# EAGLE design NightOwl_v5 (EAGLE 7.1.0)
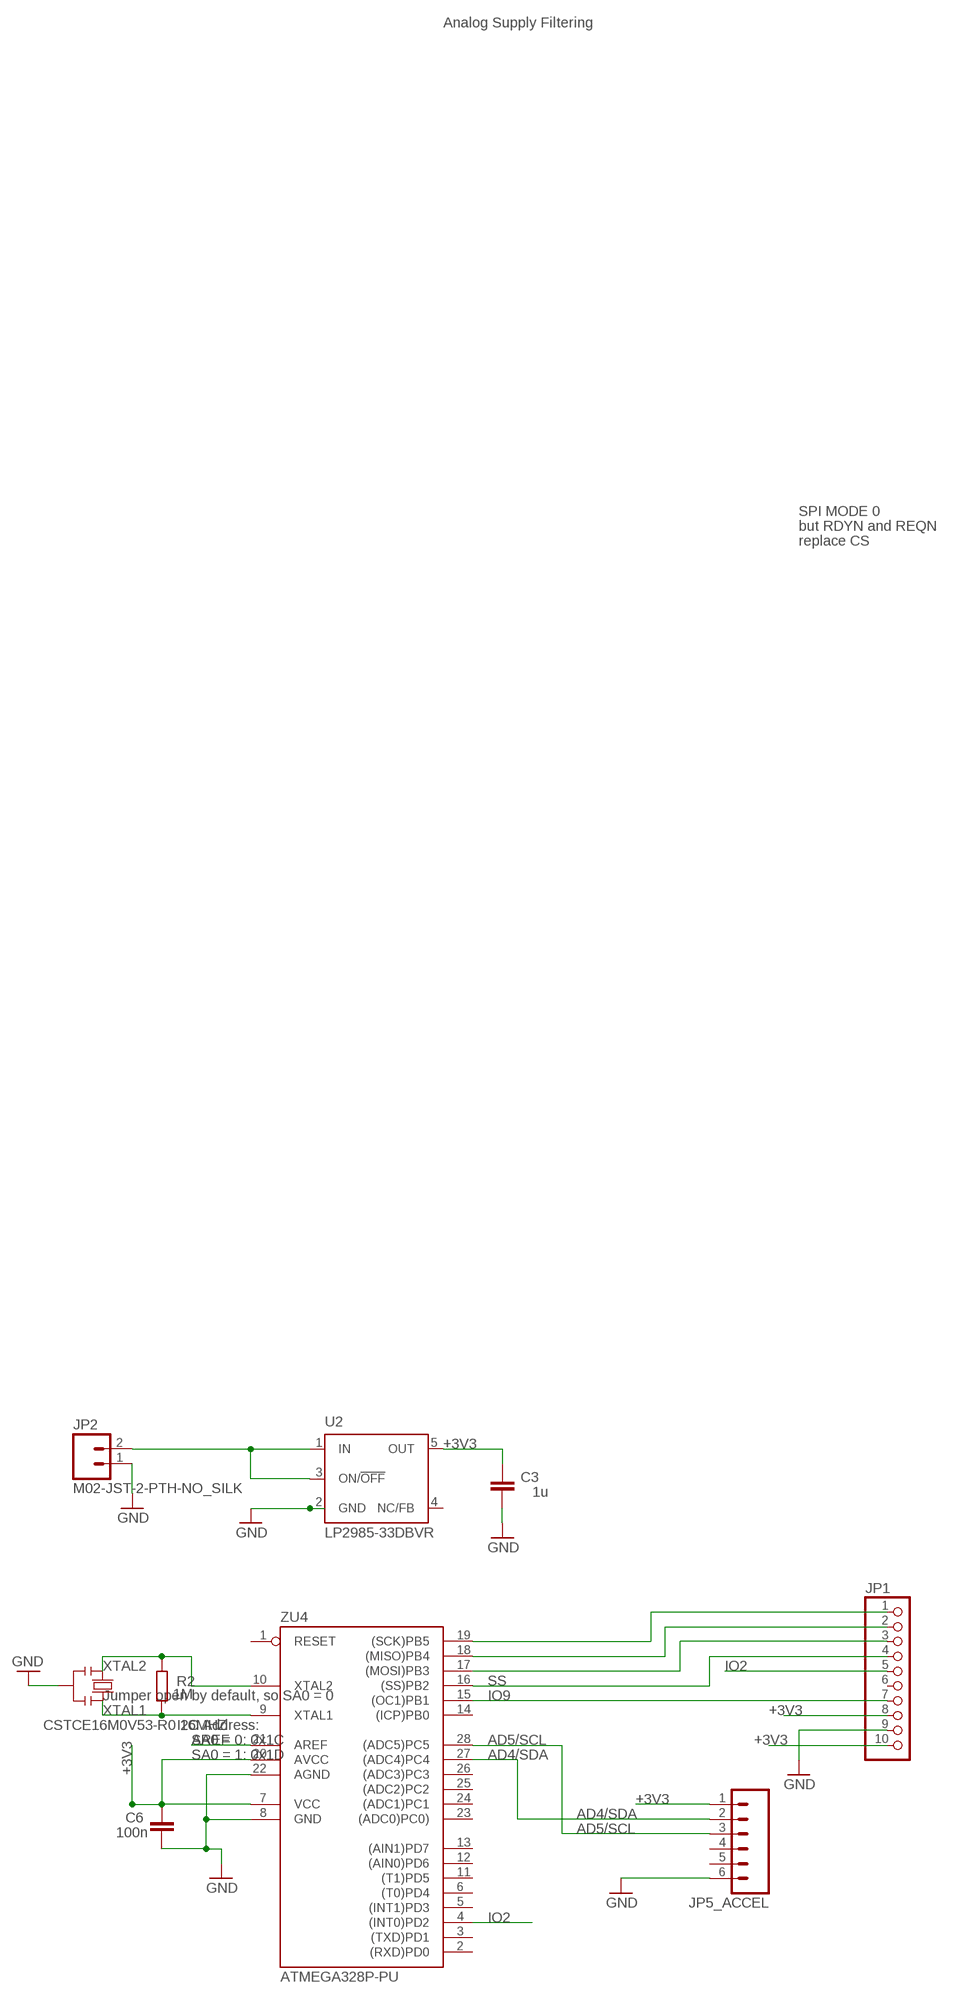
[diagram p0: schematic, sheet 1]

## Parts
C3  1u  C-EU0603-RND  [C0603-ROUND]
C6  100n  C-EU0603-RND  [C0603-ROUND]
JP1  HEADER-1X1070MIL  [1X10_ROUND70]
JP2  M02-JST-2-PTH-NO_SILK  [JST-2-PTH-NS]
JP5_ACCEL  M06SIP  [1X06]
R2  1M  R-EU_R0603  [R0603-ROUND]
U2  LP2985-33DBVR  LP2985-XXDBVR33  [SOT23-DBV]
Y2  CSTCE16M0V53-R0 16MHZ  RESONATORMU  [RESONATOR]
ZU4  ATMEGA328P-PU  [DIL28-3]

## Nets
+3V3: C3.2 C6.2 JP1.8 JP1.10 JP5_ACCEL.1 U2.5(OUT) ZU4.7(VCC) ZU4.20(AVCC)
AD4/SDA: JP5_ACCEL.2 ZU4.27((ADC4)PC4)
AD5/SCL: JP5_ACCEL.3 ZU4.28((ADC5)PC5)
AREF [aref]: ZU4.21(AREF)
GND [gnd]: C3.1 C6.1 JP1.9 JP2.1 JP5_ACCEL.6 U2.2(GND) Y2.2 ZU4.8(GND) ZU4.22(AGND)
IO2: JP1.5 ZU4.4((INT0)PD2)
IO9: JP1.7 ZU4.15((OC1)PB1)
MISO: JP1.2 ZU4.18((MISO)PB4)
MOSI: JP1.3 ZU4.17((MOSI)PB3)
N$1 [usbvcc]: JP2.2 U2.1(IN) U2.3(ON/!OFF)
SCK: JP1.1 ZU4.19((SCK)PB5)
SS: JP1.4 ZU4.16((SS)PB2)
XTAL1: R2.1 Y2.3 ZU4.9(XTAL1)
XTAL2: R2.2 Y2.1 ZU4.10(XTAL2)
Unconnected: JP1.6 JP5_ACCEL.4 JP5_ACCEL.5 U2.4(NC/FB) ZU4.1(RESET) ZU4.2((RXD)PD0) ZU4.3((TXD)PD1) ZU4.5((INT1)PD3) ZU4.6((T0)PD4) ZU4.11((T1)PD5) ZU4.12((AIN0)PD6) ZU4.13((AIN1)PD7) ZU4.14((ICP)PB0) ZU4.23((ADC0)PC0)) ZU4.24((ADC1)PC1) ZU4.25((ADC2)PC2) ZU4.26((ADC3)PC3)

## Notes on the sheet
- Analog Supply Filtering
- SPI MODE 0
- but RDYN and REQN
- replace CS
- Jumper open by default, so SA0 = 0
- I2C Address:
- SA0 = 0: 0x1C
- SA0 = 1: 0x1D

## Library data of the parts
C3 C6 = SmartPrj:C-EU: CAPACITOR, European symbol
JP1 = microbuilder:HEADER-1X10: PIN HEADER
JP2 = SparkFun-Connectors:M02: Standard 2-pin 0.1" header. Use with - straight break away headers ( PRT-00116) - right angle break away headers (PRT-00553) - swiss pins (PRT-00743) - machine pins (PRT-00117) - female headers (PRT-00115) Molex polarized connector foot print use with: PRT-08233 with associated crimp pins and housings. 2.54_SCREWTERM for use with PRT-10571. 3.5mm Screw Terminal footprints for PRT-08084 5mm Screw Terminal footprints for use with PRT-08432
JP5_ACCEL = SparkFun:M06: Header 6 Standard 6-pin 0.1" header. Use with straight break away headers (SKU : PRT-00116), right angle break away headers (PRT-00553), swiss pins (PRT-00743), machine pins (PRT-00117), and female headers (PRT-00115). Molex polarized connector foot print use with SKU : PRT-08094 with associated crimp pins and housings. NOTES ON THE VARIANTS LOCK and LOCK_LONGPADS... This footprint was designed to help hold the alignment of a through-hole component (i.e. 6-pin header) while soldering it into place. You may notice that each hole has been shifted either up or down by 0.005 of an inch from it's more standard position (which is a perfectly straight line). This slight alteration caused the pins (the squares in the middle) to touch the edges of the holes. Because they are alternating, it causes a "brace" to hold the component in place. 0.005 has proven to be the perfect amount of "off-center" position when using our standard breakaway headers. Although looks a little odd when you look at the bare footprint, once you have a header in there, the alteration is very hard to notice. Also, if you push a header all the way into place, it is covered up entirely on the bottom side. This idea of altering the position of holes to aid alignment will be further integrated into the Sparkfun Library for other footprints. It can help hold any component with 3 or more connection pins.
R2 = SmartPrj:R-EU_: RESISTOR, European symbol
U2 = SmartPrj:LP2985-XXDBVR: ULTRALOW-POWER 50-mA LOW-DROPOUT LINEAR REGULATORS 50-mA Low-Dropout Regulator Source: http://focus.ti.com/lit/ds/symlink/tps77001.pdf
Y2 = SmartPrj:RESONATOR
ZU4 = SmartPrj:ATMEGA328P-: MICROCONTROLLER 4 Kbytes FLASH 128 bytes SRAM 256 bytes EEPROM UART 6-channel 10 bit ADC

## Net classes
0 default: width 0.305 mm, drill 0.508 mm, clearance 0.254 mm
1 power: width 0.61 mm, drill 0.61 mm, clearance 0.254 mm
2 gnd: width 0.305 mm, drill 0.559 mm, clearance 0.254 mm
3 usbvcc: width 0.508 mm, drill 0.61 mm, clearance 0.254 mm
4 aref: width 0.406 mm, drill 0.61 mm, clearance 0.254 mm

## Board
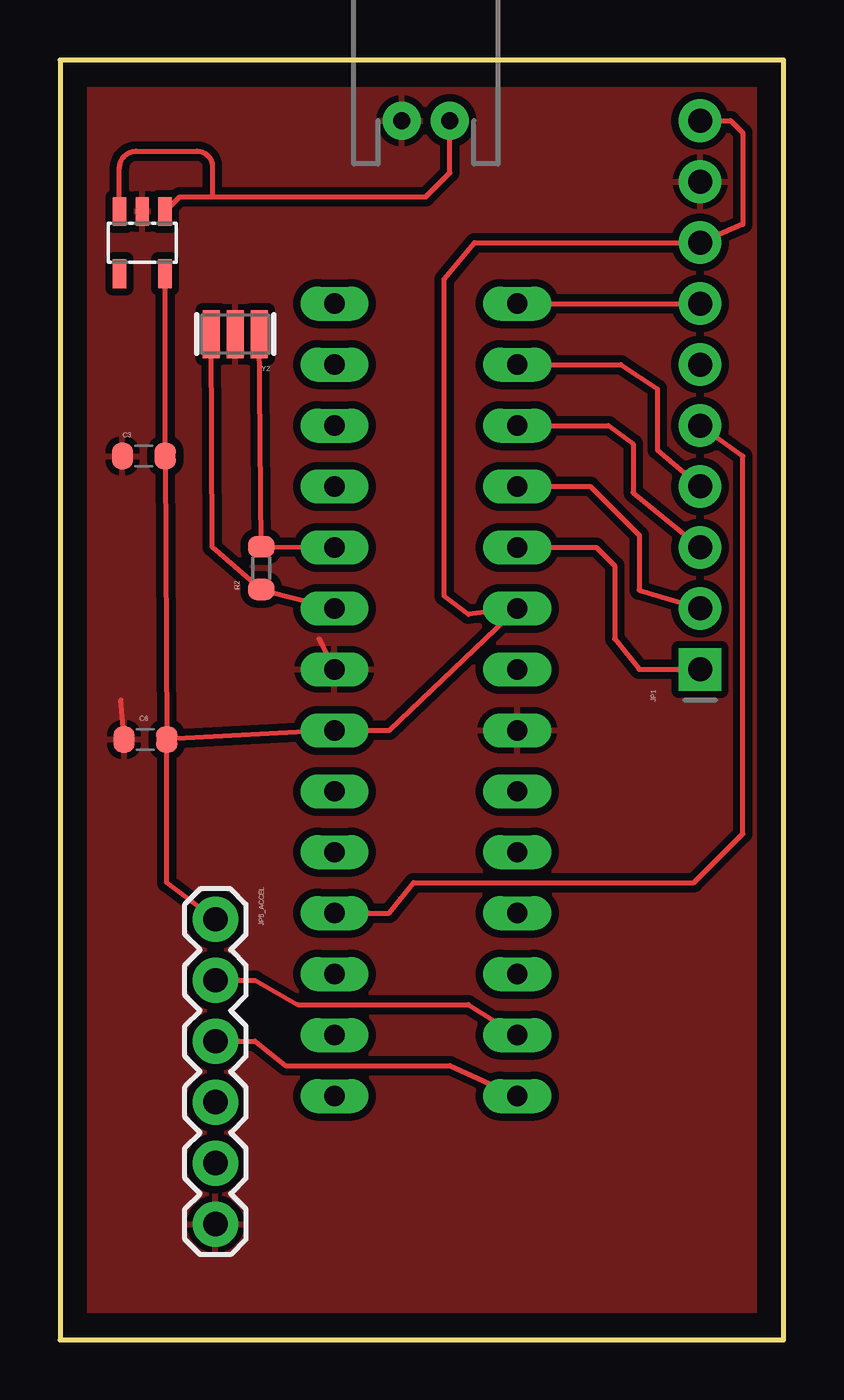
[diagram p1: board, top side]
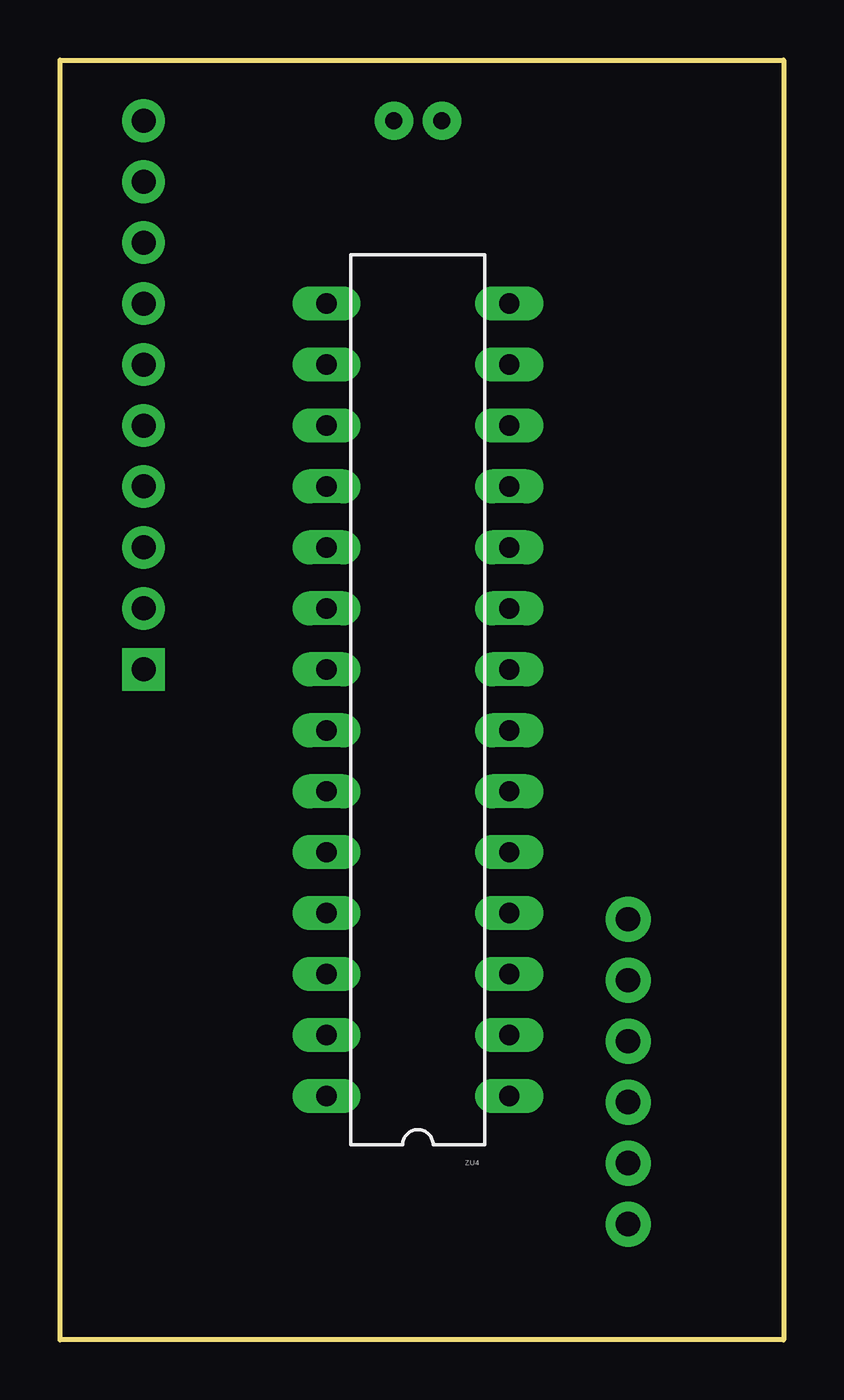
[diagram p2: board, bottom side, seen from below]

Size 30.15 x 53.33 mm. Coordinates in mm from the lower left corner, seen from the top.
Outline: 0,0 30.15,0 30.15,53.33 0,53.33 0,0
Copper layers (1*16): Top 0.035mm / dielectric 1.5mm / Bottom 0.035mm
Design rules "default": minimum track width 10mil, minimum drill 24mil, track to track 8mil, track to pad 8mil, pad to pad 8mil, via to via 8mil, smd to smd 8mil, copper to edge 40mil, drill to drill 8mil, minimum pad ring 10mil, minimum via ring 8mil, stop-mask expansion 4mil, vias tented up to drill 0mil, thermal gap 10mil

### Footprints (pad centres in the part's own frame; a part is rotated, then mirrored left to right if it is on the bottom)
C0603-ROUND = smd 0.898 x 1.1: 1 -0.889,0; 2 0.889,0
1X10_ROUND70 = drill 1 pad 1.778 square: 1 -11.43,0 | drill 1 pad 1.778: 2 -8.89,0; 3 -6.35,0; 4 -3.81,0; 5 -1.27,0; 6 1.27,0; 7 3.81,0; 8 6.35,0; 9 8.89,0; 10 11.43,0
JST-2-PTH-NS = drill 0.7 pad 1.6: 1 -1,0; 2 1,0
1X06 = drill 1.016 pad 1.88: 1 0,0; 2 2.54,0; 3 5.08,0; 4 7.62,0; 5 10.16,0; 6 12.7,0
R0603-ROUND = smd 0.898 x 1.1: 1 -0.889,0; 2 0.889,0
SOT23-DBV = smd 0.55 x 1.2: 1 -0.95,-1.3; 2 0,-1.3; 3 0.95,-1.3; 4 0.95,1.3; 5 -0.95,1.3
RESONATOR = smd 0.7 x 2: 1 -1,0; 2 0,0; 3 1,0
DIL28-3 = drill 0.85 pad 1.422 long: 1 -16.51,-3.81; 2 -13.97,-3.81; 3 -11.43,-3.81; 4 -8.89,-3.81; 5 -6.35,-3.81; 6 -3.81,-3.81; 7 -1.27,-3.81; 8 1.27,-3.81; 9 3.81,-3.81; 10 6.35,-3.81; 11 8.89,-3.81; 12 11.43,-3.81; 13 13.97,-3.81; 14 16.51,-3.81; 15 16.51,3.81; 16 13.97,3.81; 17 11.43,3.81; 18 8.89,3.81; 19 6.35,3.81; 20 3.81,3.81; 21 1.27,3.81; 22 -1.27,3.81; 23 -3.81,3.81; 24 -6.35,3.81; 25 -8.89,3.81; 26 -11.43,3.81; 27 -13.97,3.81; 28 -16.51,3.81

### Placement (x,y rotation side)
C3  3.49,36.83 0 top
C6  3.56,25.02 0 top
JP1  26.67,39.37 90 top
JP2  15.24,50.8 0 top
JP5_ACCEL  6.48,17.53 270 top
R2  8.38,32.16 90 top
U2  3.43,45.72 180 top
Y2  7.3,41.91 180 top
ZU4  15.24,26.67 90 bottom

### Tracks (layer width: path | path; a pad name or v marks a point on that pad's centre or on a via)
+3V3
  Top 0.203: C6.2 ZU4.7 13.72,25.4 ZU4.20 17.02,30.23 16,30.99 16,44.2 17.27,45.72 JP1.8 28.45,46.48 28.45,50.29 27.94,50.8 JP1.10 | U2.5 C3.2 C6.2 | JP5_ACCEL.1 4.45,19.05 C6.2
AD4/SDA
  Top 0.203: JP5_ACCEL.2 8.13,14.99 9.91,13.97 17.02,13.97 ZU4.27
AD5/SCL
  Top 0.203: JP5_ACCEL.3 8.13,12.45 9.4,11.43 16.26,11.43 ZU4.28
GND
  Top 0.203: ZU4.8 10.79,29.21 | C6.1 2.54,26.67
  pour Top (isolate 0.305): -2.54,57.15 34.29,57.15 34.29,-1.27 -3.81,-1.27 -3.81,0 -3.81,57.15
IO2
  Top 0.203: ZU4.4 13.72,17.78 14.73,19.05 26.42,19.05 28.45,21.08 28.45,36.83 JP1.5
IO9
  Top 0.203: ZU4.15 JP1.7
MISO
  Top 0.203: ZU4.18 22.1,35.56 24.13,33.53 24.13,31.24 JP1.2
MOSI
  Top 0.203: ZU4.17 22.86,38.1 23.88,37.34 23.88,35.31 JP1.3
N$1
  Top 0.203: U2.1 4.98,47.62 6.35,47.62 | 6.35,47.62 15.24,47.62 16.24,48.62 JP2.2 | U2.3 2.48,48.83 arc-90 3.17,49.53 5.71,49.53 arc-90 6.35,48.9 6.35,47.62
SCK
  Top 0.203: ZU4.19 22.35,33.02 23.11,32.26 23.11,29.21 24.13,27.94 JP1.1
SS
  Top 0.203: ZU4.16 23.37,40.64 24.89,39.62 24.89,37.08 JP1.4
XTAL1
  Top 0.203: Y2.3 6.35,33.02 R2.1 ZU4.9
XTAL2
  Top 0.203: ZU4.10 R2.2 Y2.1